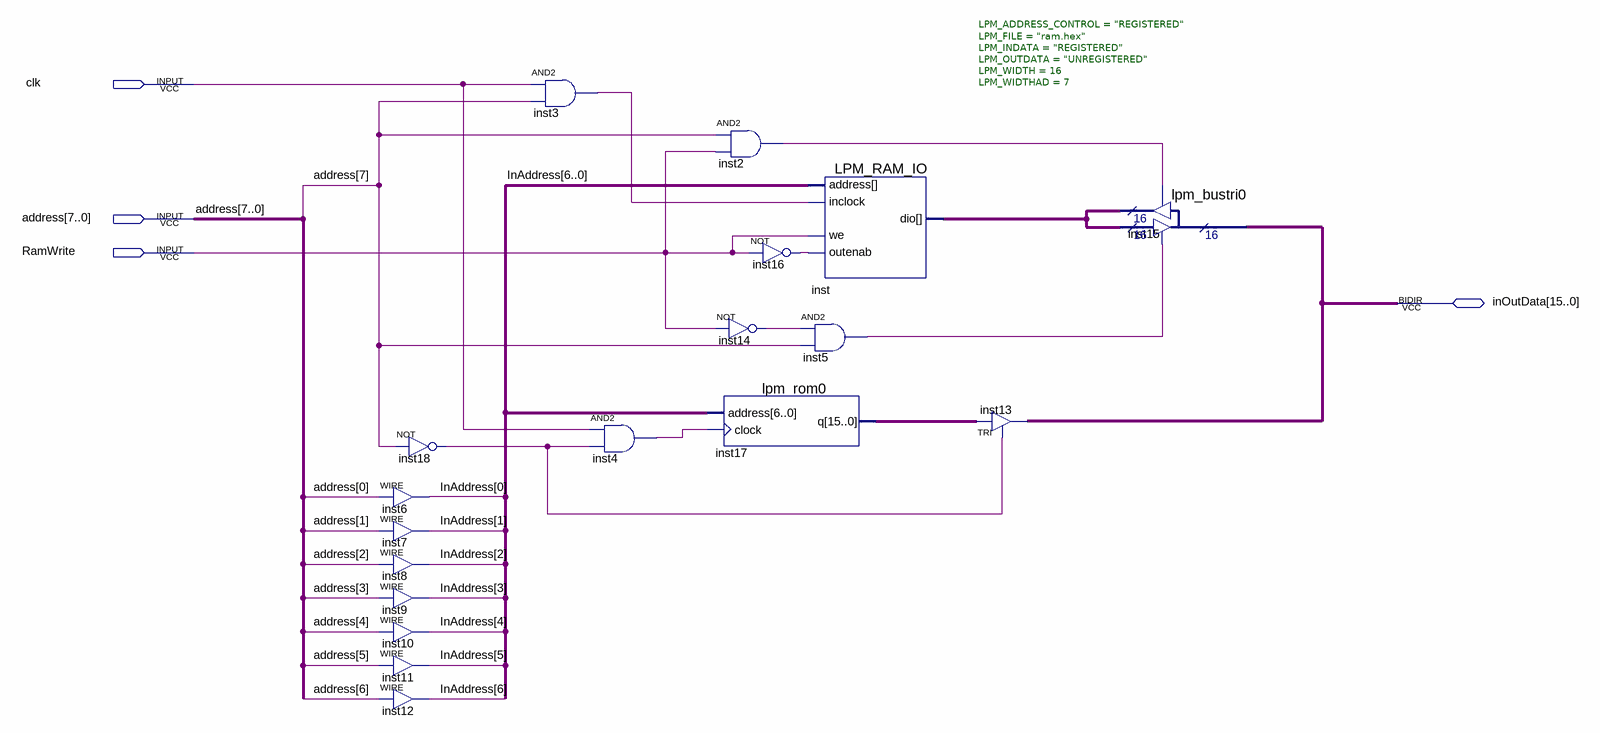
[diagram p0: schematic sheet]
// Quartus schematic memory.bdf as structural Verilog: 18 symbols, 4 pins
module memory (
  input  clk,
  input  [7:0] address,
  input  RamWrite,
  inout  [15:0] inOutData
);

  wire inst2_out, inst3_out, inst4_out, inst5_out, inst14_out, inst16_out, inst18_out;
  wire [6:0] InAddress;
  wire [15:0] inst17_q, inst_dio;

  not inst18 (inst18_out, address[7]);
  assign InAddress[0] = address[0];  // WIRE inst6
  assign InAddress[1] = address[1];  // WIRE inst7
  assign InAddress[2] = address[2];  // WIRE inst8
  assign InAddress[3] = address[3];  // WIRE inst9
  assign InAddress[4] = address[4];  // WIRE inst10
  assign InAddress[5] = address[5];  // WIRE inst11
  assign InAddress[6] = address[6];  // WIRE inst12
  and inst3 (inst3_out, clk, address[7]);
  and inst4 (inst4_out, clk, inst18_out);
  lpm_rom0 inst17 (.address(InAddress), .clock(inst4_out), .q(inst17_q));
  and inst2 (inst2_out, address[7], RamWrite);
  not inst16 (inst16_out, RamWrite);
  not inst14 (inst14_out, RamWrite);
  LPM_RAM_IO #(.LPM_ADDRESS_CONTROL("REGISTERED"), .LPM_FILE("ram.hex"), .LPM_INDATA("REGISTERED"), .LPM_OUTDATA("UNREGISTERED"), .LPM_WIDTH(16), .LPM_WIDTHAD(7)) inst (
    .address(InAddress), .inclock(inst3_out), .we(RamWrite), .outenab(inst16_out), .dio(inst_dio));
  and inst5 (inst5_out, inst14_out, address[7]);
  TRI inst13[15:0] (.IN(inst17_q), .OE(inst18_out), .OUT(inOutData));
  lpm_bustri0 inst15 (
    .enabledt(inst5_out), .data(inst_dio), .enabletr(inst2_out), .result(inst_dio), .tridata(inOutData));
endmodule
